# EAGLE design skyshieldv2.0 (EAGLE 7.2.0)
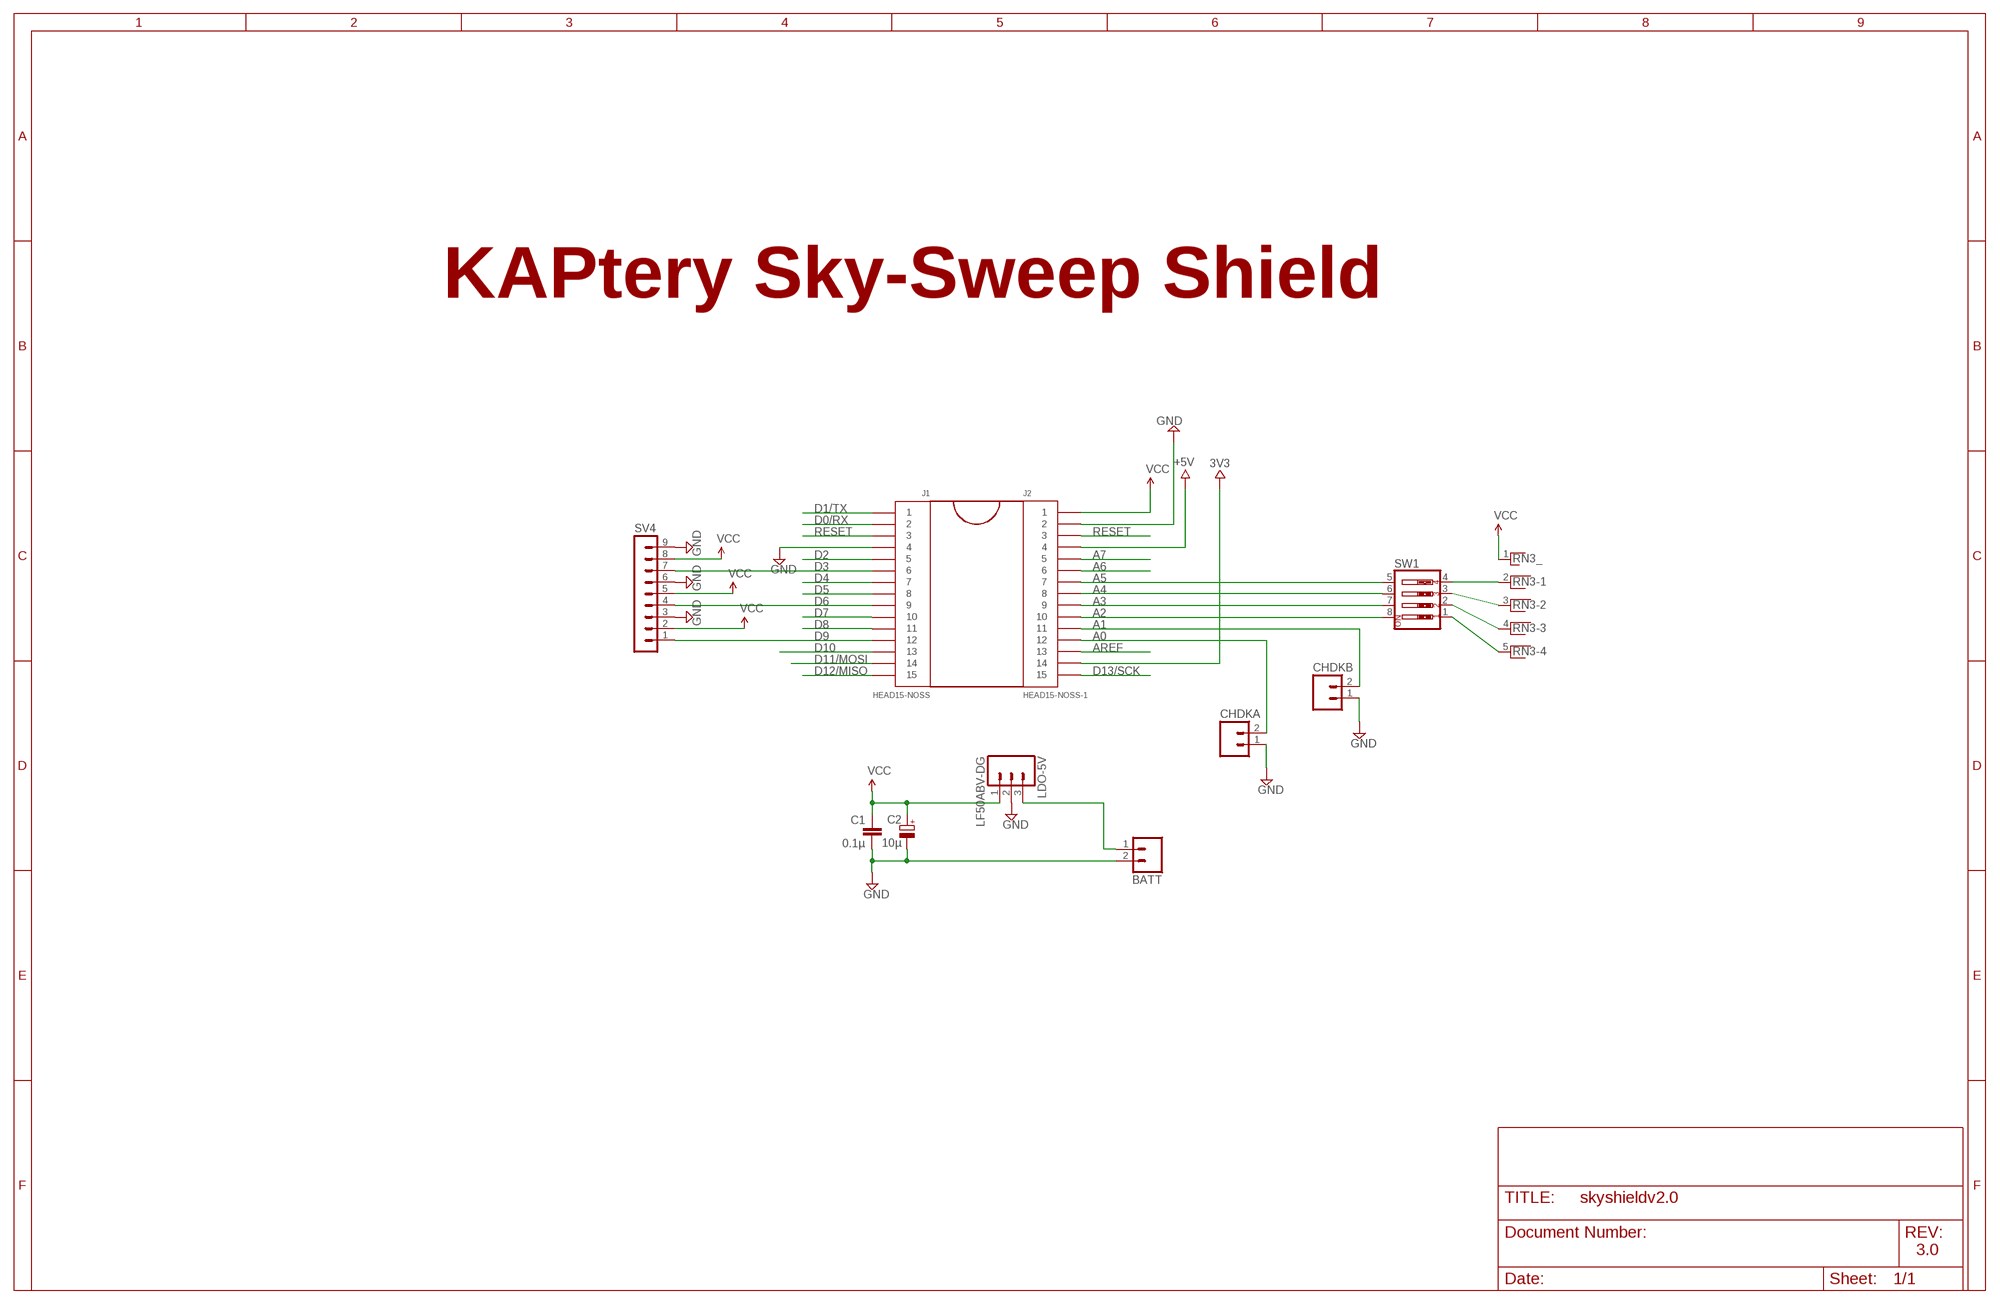
[diagram p0: schematic, sheet 1]

## Parts
BATT  M02PTH  [1X02]
C1  0.1µ  C-EU025-024X044  [C025-024X044]
C2  10µ  CPOL-EUE1.8-4  [E1,8-4]
CHDKA  M02PTH  [1X02]
CHDKB  M02PTH  [1X02]
J1  HEAD15-NOSS  [HEAD15-NOSS]
J2  HEAD15-NOSS-1  [HEAD15-NOSS-1]
LDO-5V  LF50ABV-DG  M03PTH  [1X03]
RN3  RNX4  [RN-5]
SV4  MA09-1  [MA09-1]
SW1  SW_DIP-4  [EDG-04]

## Nets
3V3: J2.14
+5V: J2.4
A0: CHDKA.2 J2.12
A1: CHDKB.2 J2.11
A2: J2.10 SW1.8
A3: J2.9 SW1.7
A4: J2.8 SW1.6
A5: J2.7 SW1.5
A6: J2.6
A7: J2.5
AREF: J2.13
D0/RX: J1.2
D1/TX: J1.1
D2: J1.5
D3: J1.6 SV4.7
D4: J1.7
D5: J1.8
D6: J1.9 SV4.4
D7: J1.10
D8: J1.11
D9: J1.12 SV4.1
D10: J1.13
D11/MOSI: J1.14
D12/MISO: J1.15
D13/SCK: J2.15
GND [power]: BATT.2 C1.2 C2.- CHDKA.1 CHDKB.1 J1.4 J2.2 LDO-5V.2 SV4.3 SV4.6 SV4.9
N$5: RN3.2 SW1.4
N$6: BATT.1 LDO-5V.3
N$7: RN3.3 SW1.3
N$8: RN3.4 SW1.2
N$9: RN3.5 SW1.1
RESET: J1.3 J2.3
VCC [power]: C1.1 C2.+ J2.1 LDO-5V.1 RN3.1 SV4.2 SV4.5 SV4.8

## Notes on the sheet
- KAPtery Sky-Sweep Shield
- 3.0

## Library data of the parts
BATT CHDKA CHDKB = SparkFun-Connectors:M02: Standard 2-pin 0.1" header. Use with - straight break away headers ( PRT-00116) - right angle break away headers (PRT-00553) - swiss pins (PRT-00743) - machine pins (PRT-00117) - female headers (PRT-00115) Molex polarized connector foot print use with: PRT-08233 with associated crimp pins and housings. 2.54_SCREWTERM for use with PRT-10571. 3.5mm Screw Terminal footprints for PRT-08084 5mm Screw Terminal footprints for use with PRT-08432
C1 = resistor:C-EU: CAPACITOR, European symbol
C2 = resistor:CPOL-EU: POLARIZED CAPACITOR, European symbol
J1 = MyCON2:HEAD15-NOSS
J2 = MyCON2:HEAD15-NOSS-1
LDO-5V = SparkFun-Connectors:M03: Header 3 Standard 3-pin 0.1" header. Use with straight break away headers (SKU : PRT-00116), right angle break away headers (PRT-00553), swiss pins (PRT-00743), machine pins (PRT-00117), and female headers (PRT-00115). Molex polarized connector foot print use with SKU : PRT-08232 with associated crimp pins and housings.
RN3 = resistor-net:RNX4: RESISTOR NETWORK; OC_FARNELL: unknown; OC_NEWARK: unknown
SV4 = con-lstb:MA09-1: PIN HEADER; OC_FARNELL: unknown; OC_NEWARK: unknown
SW1 = special:SW_DIP-4: DIP SWITCH

## Net classes
0 default: width 0.406 mm, clearance 0.203 mm
1 power: width 0.813 mm, clearance 0.203 mm

## Board
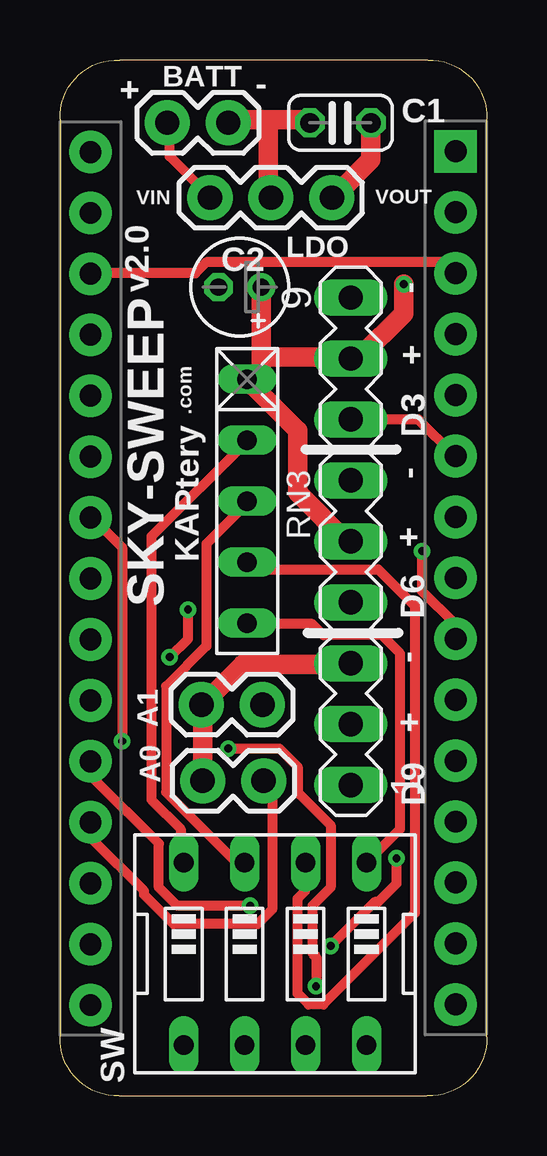
[diagram p1: board, top side]
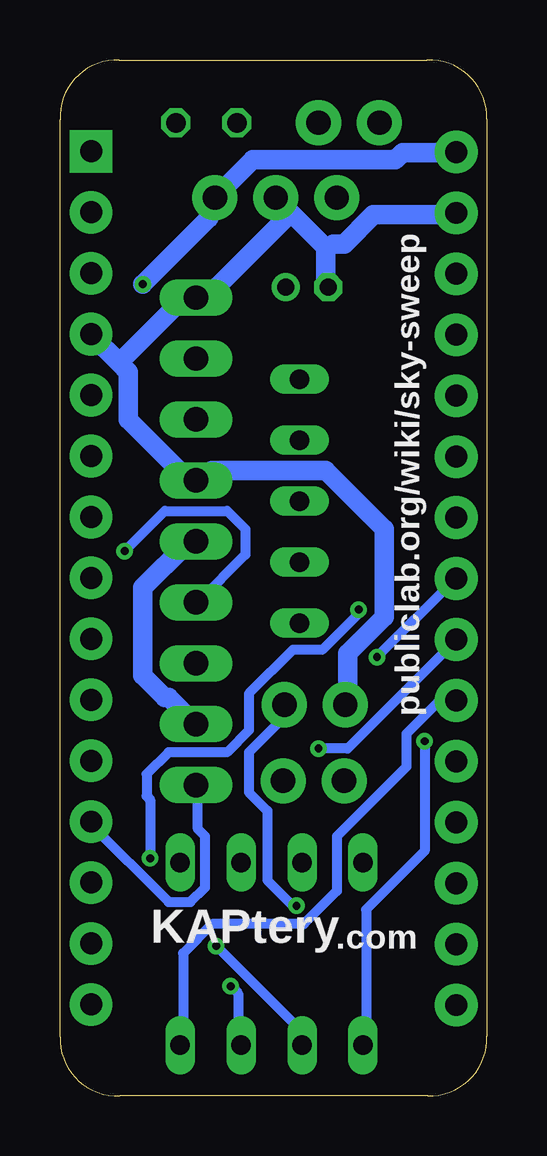
[diagram p2: board, bottom side, seen from below]

Size 17.78 x 43.18 mm. Coordinates in mm from the lower left corner, seen from the top.
Outline: 2.46,0 15.29,0 arc94 17.78,2.46 17.78,40.69 arc94 15.32,43.18 2.49,43.18 arc94 0,40.72 0,2.49 arc94 2.46,0
Copper layers (1*16): Top 0.0356mm / dielectric 1.5011mm / Bottom 0.0356mm
Design rules "LaenPCBOrder": minimum track width 6mil, minimum drill 13mil, track to track 6mil, track to pad 6mil, pad to pad 6mil, via to via 6mil, smd to smd 6mil, copper to edge 15mil, drill to drill 6mil, minimum pad ring 7mil, minimum via ring 7mil, stop-mask expansion 3mil, vias tented up to drill 0mil, thermal gap 10mil

### Footprints (pad centres in the part's own frame; a part is rotated, then mirrored left to right if it is on the bottom)
1X02 = drill 1.016 pad 1.88: 1 0,0; 2 2.54,0
C025-024X044 = drill 0.813 octagon: 1 -1.27,0; 2 1.27,0
E1,8-4 = drill 0.711 pad 1.168: + -0.889,0 | drill 0.711 pad 1.168 octagon: - 0.889,0
HEAD15-NOSS = drill 0.914 pad 1.778 square: 1 0,0 | drill 0.914 pad 1.778: 2 2.54,0; 3 5.08,0; 4 7.62,0; 5 10.16,0; 6 12.7,0; 7 15.24,0; 8 17.78,0; 9 20.32,0; 10 22.86,0; 11 25.4,0; 12 27.94,0; 13 30.48,0; 14 33.02,0; 15 35.56,0
HEAD15-NOSS-1 = drill 0.914 pad 1.778: 1 0,0; 2 2.54,0; 3 5.08,0; 4 7.62,0; 5 10.16,0; 6 12.7,0; 7 15.24,0; 8 17.78,0; 9 20.32,0; 10 22.86,0; 11 25.4,0; 12 27.94,0; 13 30.48,0; 14 33.02,0; 15 35.56,0
1X03 = drill 1.016 pad 1.88: 1 0,0; 2 2.54,0; 3 5.08,0
RN-5 = drill 0.813 long: 1 -5.08,0; 2 -2.54,0; 3 0,0; 4 2.54,0; 5 5.08,0
MA09-1 = drill 1.016 long: 1 -10.16,0; 2 -7.62,0; 3 -5.08,0; 4 -2.54,0; 5 0,0; 6 2.54,0; 7 5.08,0; 8 7.62,0; 9 10.16,0
EDG-04 = drill 0.813 long: 1 -3.81,-3.81; 2 -1.27,-3.81; 3 1.27,-3.81; 4 3.81,-3.81; 5 3.81,3.81; 6 1.27,3.81; 7 -1.27,3.81; 8 -3.81,3.81

### Placement (x,y rotation side)
BATT  4.47,40.56 0 top
C1  11.68,40.56 180 top
C2  7.49,33.71 180 top
CHDKA  5.94,13.13 0 top
CHDKB  5.89,16.31 0 top
J1  16.48,39.37 270 top
J2  1.27,39.34 270 top
LDO-5V  11.33,37.44 180 top
RN3  7.8,24.79 270 top
SV4  12.12,23.11 90 top
SW1  8.97,5.92 180 top

### Tracks (layer width: path | path; a pad name or v marks a point on that pad's centre or on a via)
A0
  Top 0.406: J2.12 1.37,11.28 1.37,10.67 3.5,8.53 3.5,8.38 4.72,7.16 8.23,7.16 8.84,7.77 8.84,12.8 8.53,13.11 CHDKA.2
A1  (via drill 0.33)
  Top 0.406: v7.92,7.92 4.88,7.92 4.12,8.69 4.12,10.52 1.37,13.26 1.37,13.87 J2.11
  Bottom 0.406: v7.92,7.92 8.08,7.92 9.14,8.99 9.14,11.89 9.91,12.65 9.91,14.33 8.53,15.7 8.53,16.31 CHDKB.2
A2
  Bottom 0.406: SW1.8 12.65,2.13 12.65,5.94 11.43,7.16 7.62,7.16 6.25,8.53 6.25,10.82 3.35,13.72 3.35,15.09 1.98,16.46 1.37,16.46 J2.10
A3  (via drill 0.33)
  Top 0.406: v10.67,4.57 10.67,5.79 10.52,5.94 10.52,7.92 11.28,8.69 11.28,11.28 9.91,12.65 9.91,13.72 9.14,14.48 v7.01,14.48
  Bottom 0.406: v10.67,4.57 10.36,4.27 10.36,2.13 SW1.7 | v7.01,14.48 5.79,14.48 1.37,18.9 J2.9
A4  (via drill 0.33)
  Top 0.406: v11.28,6.25 13.11,8.08 13.26,8.08 14.02,8.84 v14.02,9.91 | v5.33,20.27 5.33,19.05 v4.57,18.29
  Bottom 0.406: v11.28,6.25 7.77,2.74 7.77,2.13 SW1.6 | v14.02,9.91 14.02,12.34 14.17,12.5 14.17,13.41 13.26,14.33 10.82,14.33 9.91,15.24 9.91,16.76 8.08,18.59 6.86,18.59 5.33,20.12 v5.33,20.27 | v4.57,18.29 1.37,21.49 J2.8
A5  (via drill 0.33)
  Top 0.406: v2.59,14.78 2.59,22.86 1.37,24.08 J2.7
  Bottom 0.406: v2.59,14.78 2.59,10.21 5.03,7.77 5.03,2.13 SW1.5
D3
  Top 0.406: SV4.7 14.94,28.19 16.46,26.67 J1.6
D6  (via drill 0.33)
  Top 0.406: v15.09,22.71 15.09,21.03 16.46,19.66 16.46,19.05 J1.9
  Bottom 0.406: v15.09,22.71 13.41,24.38 10.82,24.38 10.06,23.62 10.06,22.55 12.04,20.57 SV4.4
D9
  Bottom 0.406: SV4.1 12.04,12.95 12.04,11.12 11.73,10.82 11.73,8.69 12.34,8.08 13.26,8.08 16.61,11.43 J1.12
GND
  Top 0.813: 8.69,40.69 7.01,40.69 BATT.2 | 8.69,40.69 10.36,40.69 C1.2 | 8.69,40.69 8.69,37.49 LDO-5V.2 | SV4.3 12.04,17.98 7.62,17.98 5.94,16.31 CHDKB.1 5.94,16 CHDKA.1
  Bottom 0.813: 6.71,35.36 6.71,33.83 C2.- | 6.71,35.36 LDO-5V.2 8.38,36.58 11.73,33.22 SV4.9 12.19,33.22 12.65,33.22 15.32,30.56 | J2.2 1.37,36.73 4.72,36.73 5.94,35.51 6.4,35.51 6.71,35.36 | 15.32,30.56 16.46,31.7 J1.4 | 15.32,30.56 14.94,30.18 14.94,28.19 12.5,25.76 12.19,25.76 SV4.6 11.73,25.76 11.43,26.06 6.71,26.06 4.27,23.62 4.27,19.96 5.79,18.44 5.79,16.31 CHDKB.1
N$5
  Top 0.406: SW1.4 5.03,9.75 5.03,11.12 3.81,12.34 3.81,23.32 7.77,27.28 RN3.2
N$6
  Top 0.406: BATT.1 4.57,40.54 4.57,39.17 6.25,37.49 LDO-5V.3
N$7
  Top 0.406: SW1.3 7.62,9.75 7.32,9.75 4.42,12.65 4.42,17.07 6.1,18.75 6.1,23.01 7.77,24.69 RN3.3
N$8
  Top 0.406: SW1.2 10.21,9.6 10.21,8.53 9.91,8.23 9.91,4.27 10.36,3.81 10.97,3.81 14.78,7.62 14.78,20.42 13.26,21.95 8.23,21.95 7.92,22.25 RN3.4
N$9
  Top 0.406: SW1.1 14.17,11.12 14.17,18.44 13.41,19.2 10.97,19.2 10.52,19.66 7.92,19.66 RN3.5
RESET
  Top 0.406: J2.3 1.37,34.29 5.64,34.29 6.1,34.75 16,34.75 16.46,34.29 J1.3
VCC  (via drill 0.33)
  Top 0.813: C1.1 12.95,39.01 11.43,37.49 LDO-5V.1 | 8.38,30.79 8.38,30.33 7.92,29.87 RN3.1 8.08,29.57 9.91,27.74 9.91,25.15 12.04,23.01 SV4.5 | 8.38,30.79 C2.+ | 8.38,30.79 12.04,30.79 SV4.8 12.5,30.79 14.33,32.61 v14.33,33.83
  Bottom 0.813: J2.1 1.37,39.32 3.5,39.32 3.81,39.01 9.75,39.01 LDO-5V.1 11.58,37.19 11.58,36.58 v14.33,33.83 | SV4.2 12.19,15.54 13.26,16.61 13.41,16.61 14.33,17.53 14.33,21.18 12.5,23.01 12.19,23.01 SV4.5

### Text on the board
tPlace: BATT | + | - | C1 | VIN | VOUT | v2.0 | LDO | C2 | - | + | D3 | KAPtery | .com | - | + | D6 | SKY-SWEEP | - | + | A0 | A1 | D9 | SW
bPlace: publiclab.org/wiki/sky-sweep | KAPtery | .com